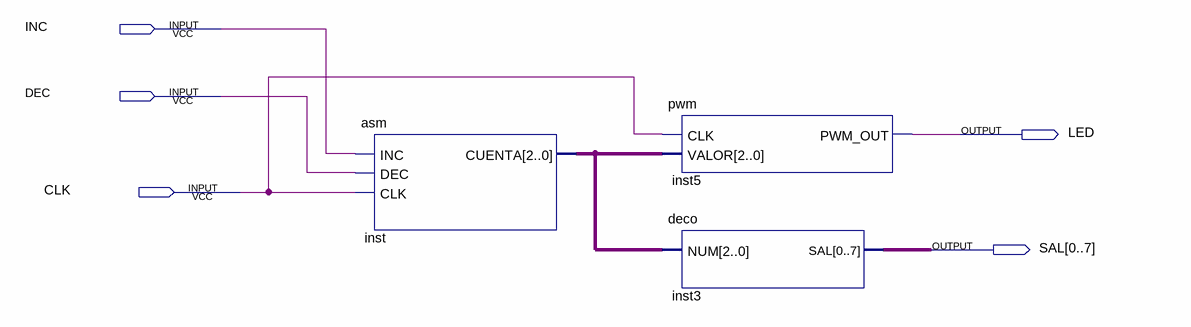
[diagram p0: schematic sheet]
// Quartus schematic Practica05.bdf as structural Verilog: 3 symbols, 5 pins
module Practica05 (
  input  INC,
  input  DEC,
  input  CLK,
  output LED,
  output [0:7] SAL
);

  wire [2:0] inst_cuenta;

  asm inst (.INC(INC), .DEC(DEC), .CLK(CLK), .CUENTA(inst_cuenta));
  pwm inst5 (.CLK(CLK), .VALOR(inst_cuenta), .PWM_OUT(LED));
  deco inst3 (.NUM(inst_cuenta), .SAL(SAL));
endmodule
